# EAGLE design ISS-Notify (EAGLE 7.1.0)
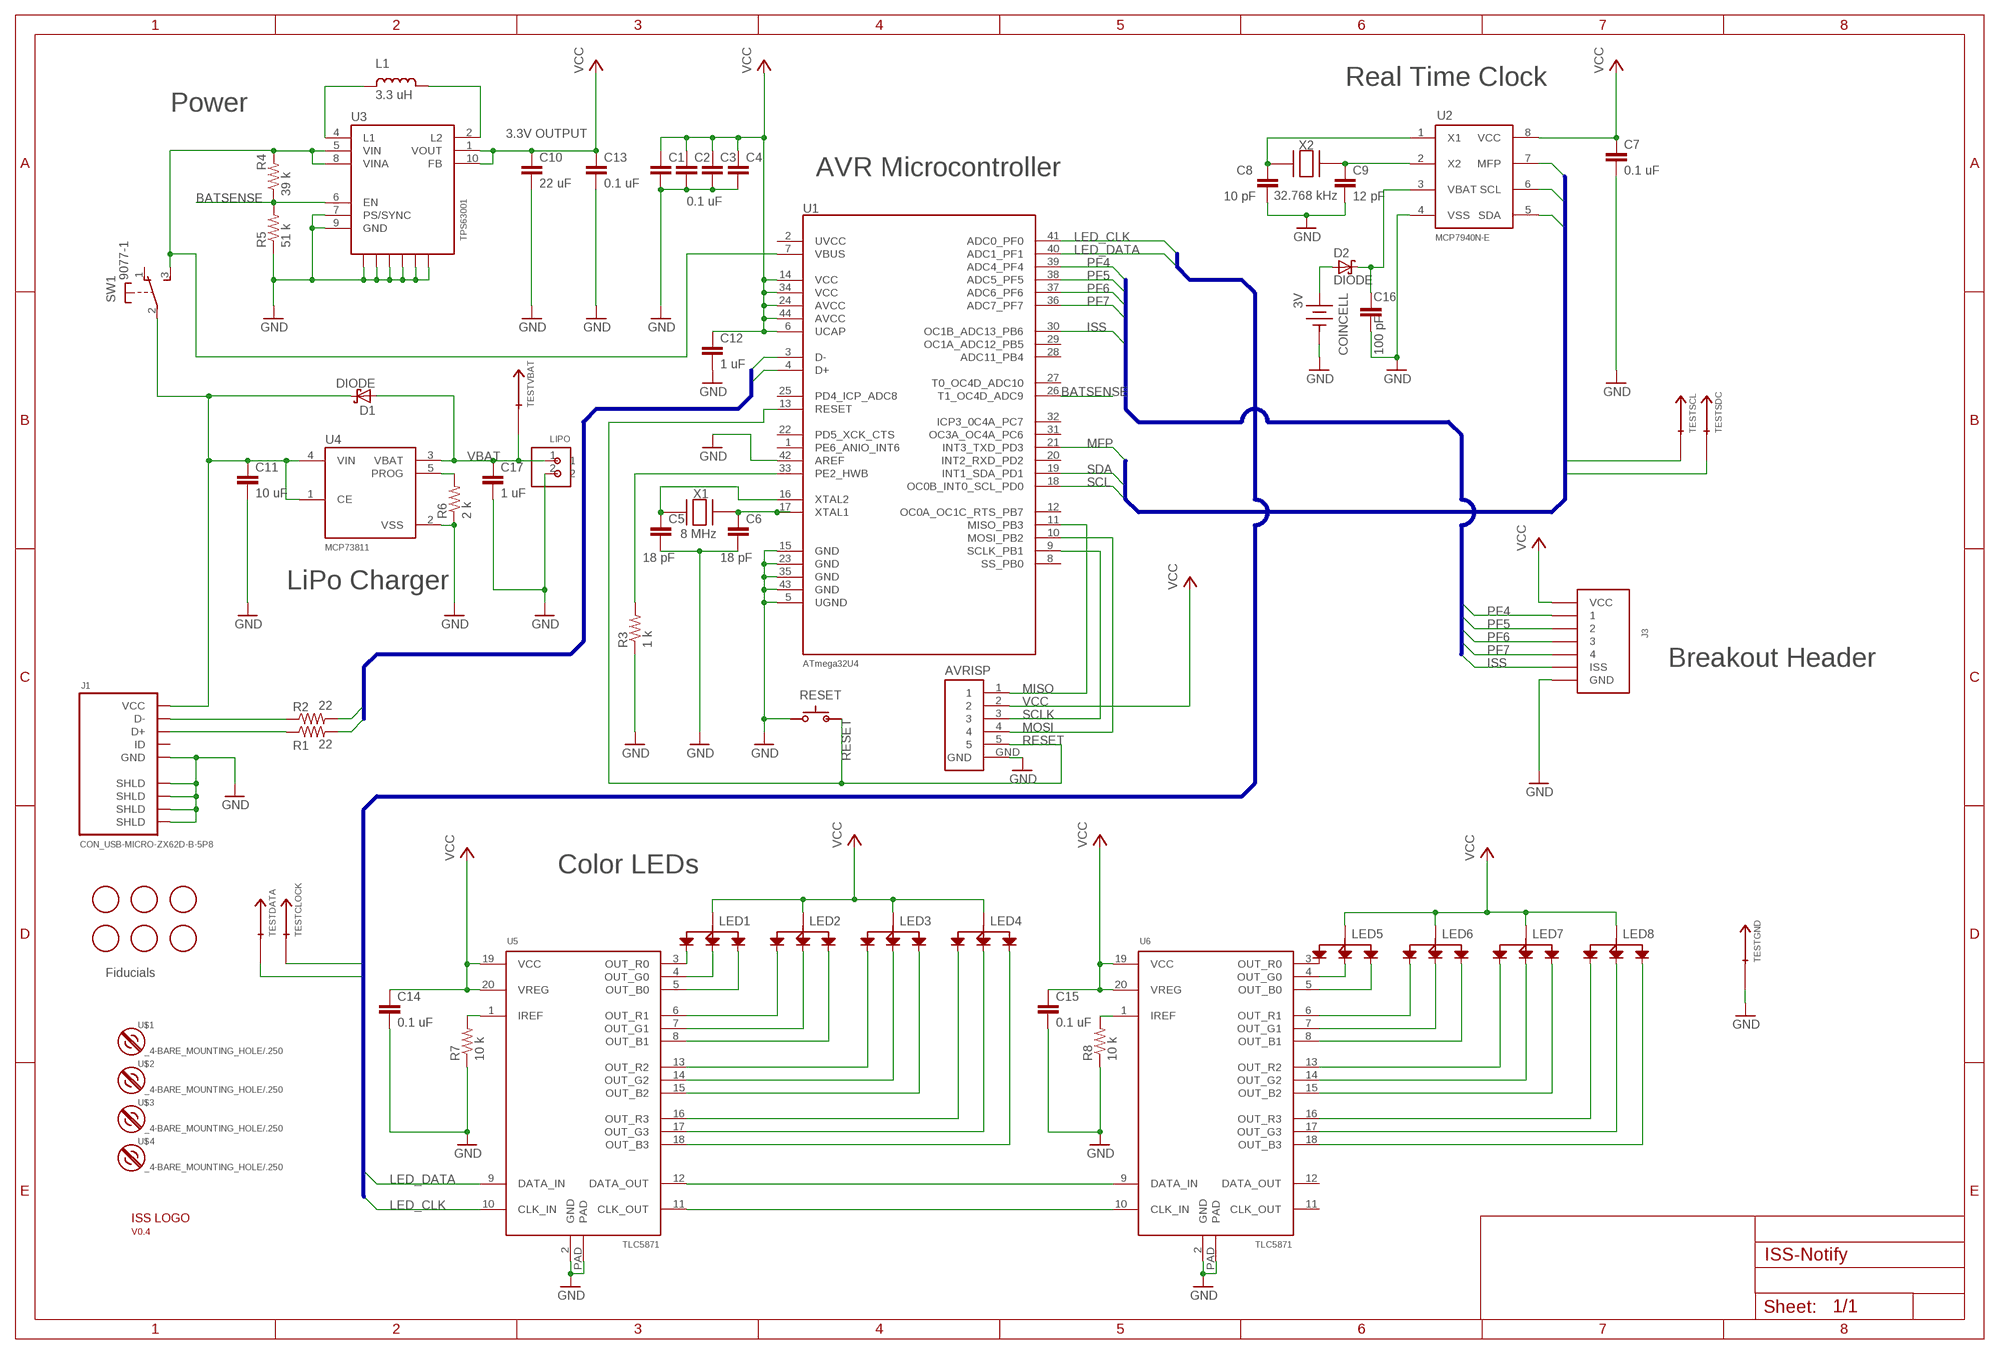
[diagram p0: schematic, sheet 1]

## Parts
AVRISP  AVRISP  [AVRISP]
C1  0.1 uF  C-EU0603-C-NOSILK  [0603-C-NOSILK]
C2  0.1 uF  C-EU0603-C-NOSILK  [0603-C-NOSILK]
C3  0.1 uF  C-EU0603-C-NOSILK  [0603-C-NOSILK]
C4  0.1 uF  C-EU0603-C-NOSILK  [0603-C-NOSILK]
C5  18 pF  C-EU0603-C-NOSILK  [0603-C-NOSILK]
C6  18 pF  C-EU0603-C-NOSILK  [0603-C-NOSILK]
C7  0.1 uF  C-EU0603-C-NOSILK  [0603-C-NOSILK]
C8  10 pF  C-EU0603-C-NOSILK  [0603-C-NOSILK]
C9  12 pF  C-EU0603-C-NOSILK  [0603-C-NOSILK]
C10  22 uF  C-EU0805-C-NOSILK  [0805-C-NOSILK]
C11  10 uF  C-EU0805-C-NOSILK  [0805-C-NOSILK]
C12  1 uF  C-EU0603-C-NOSILK  [0603-C-NOSILK]
C13  0.1 uF  C-EU0603-C-NOSILK  [0603-C-NOSILK]
C14  0.1 uF  C-EU0603-C-NOSILK  [0603-C-NOSILK]
C15  0.1 uF  C-EU0603-C-NOSILK  [0603-C-NOSILK]
C16  100 pF  C-EU0603-C-NOSILK  [0603-C-NOSILK]
C17  1 uF  C-EU0603-C-NOSILK  [0603-C-NOSILK]
COINCELL  3V  COINCELL  [COINCELL]
D1  DIODE  [0805-DIODE]
D2  DIODE  [0805-DIODE]
J1  CON_USB-MICRO-ZX62D-B-5P8  [USBMICROSMT-HIROSE]
J3  PROTOSPACE2  [PROTOSPACE2]
L1  3.3 uH  PWR_INDUCTOR  [0805-C-NOSILK]
LED1  RGBLED  [SMDRGBLED]
LED2  RGBLED  [SMDRGBLED]
LED3  RGBLED  [SMDRGBLED]
LED4  RGBLED  [SMDRGBLED]
LED5  RGBLED  [SMDRGBLED]
LED6  RGBLED  [SMDRGBLED]
LED7  RGBLED  [SMDRGBLED]
LED8  RGBLED  [SMDRGBLED]
LIPO  JST2  [JSTHEAD]
R1  22  R-US_0603-C-NOSILK  [0603-C-NOSILK]
R2  22  R-US_0603-C-NOSILK  [0603-C-NOSILK]
R3  1 k  R-US_0603-C-NOSILK  [0603-C-NOSILK]
R4  39 k  R-US_0603-C-NOSILK  [0603-C-NOSILK]
R5  51 k  R-US_0603-C-NOSILK  [0603-C-NOSILK]
R6  2 k  R-US_0603-C-NOSILK  [0603-C-NOSILK]
R7  10 k  R-US_0603-C-NOSILK  [0603-C-NOSILK]
R8  10 k  R-US_0603-C-NOSILK  [0603-C-NOSILK]
RESET  SWITCH  [SWITCH]
SW1  9077-1  [ESWITCH]
TESTCLOCK  TESTPIN  [TESTPIN]
TESTDATA  TESTPIN  [TESTPIN]
TESTGND  TESTPIN  [TESTPIN]
TESTSCL  TESTPIN  [TESTPIN]
TESTSDC  TESTPIN  [TESTPIN]
TESTVBAT  TESTPIN  [TESTPIN]
U1  ATMEGA32U4  [TQFP-44]
U2  MCP7940N  [MCP7940N]
U3  TPS63001  [QFN10]
U4  MCP73811  [SOT23-5L]
U5  TLC5971  [R-PDSO-G20]
U6  TLC5971  [R-PDSO-G20]
U$1  _4-BARE_MOUNTING_HOLE/.250  [_4/.250-BARE+STD_WASHER]
U$2  _4-BARE_MOUNTING_HOLE/.250  [_4/.250-BARE+STD_WASHER]
U$3  _4-BARE_MOUNTING_HOLE/.250  [_4/.250-BARE+STD_WASHER]
U$4  _4-BARE_MOUNTING_HOLE/.250  [_4/.250-BARE+STD_WASHER]
U$5  V0.4  LOGO  [LOGO]
U$6  FIDUCIAL  [FIDUCIAL_1MM]
U$7  FIDUCIAL  [FIDUCIAL_1MM]
U$8  FIDUCIAL  [FIDUCIAL_1MM]
U$9  FIDUCIAL  [FIDUCIAL_1MM]
U$10  FIDUCIAL  [FIDUCIAL_1MM]
U$11  FIDUCIAL  [FIDUCIAL_1MM]
X1  8 MHz  CX5Z  [CX5Z]
X2  32.768 kHz  ABS10  [ABS10]

## Nets
BATSENSE: R4.1 R5.2 U1.26(T1_OC4D_ADC9) U3.6(EN)
D+: R1.2 U1.4(D+)
D-: R2.2 U1.3(D-)
GND: AVRISP.GND C1.2 C2.2 C3.2 C4.2 C5.2 C6.2 C7.2 C8.2 C9.2 C10.2 C11.2 C12.2 C13.2 C14.2 C15.2 C16.2 C17.2 COINCELL.GND J1.P5(GND) J1.P$1(SHLD) J1.P$2(SHLD) J1.P$3(SHLD) J1.P$4(SHLD) J3.GND LIPO.2 R3.1 R5.1 R6.1 R7.1 R8.1 RESET.3 TESTGND.P$1(TEST) U1.5(UGND) U1.15(GND) U1.23(GND) U1.35(GND) U1.42(AREF) U1.43(GND) U2.4(VSS) U3.3(PGND) U3.7(PS/SYNC) U3.9(GND) U3.PAD(GNDPAD) U3.PGND1 U3.PGND2 U3.PGND3 U3.PGND4 U4.2(VSS) U5.2(GND) U5.PAD U6.2(GND) U6.PAD
ISS: J3.ISS U1.30(OC1B_ADC13_PB6)
LED_CLK: TESTCLOCK.P$1(TEST) U1.41(ADC0_PF0) U5.10(CLK_IN)
LED_DATA: TESTDATA.P$1(TEST) U1.40(ADC1_PF1) U5.9(DATA_IN)
MFP: U1.21(INT3_TXD_PD3) U2.7(MFP)
MISO: AVRISP.1 U1.11(MISO_PB3)
MOSI: AVRISP.4 U1.10(MOSI_PB2)
N$1: L1.1(A) U3.4(L1)
N$2: L1.2(C) U3.2(L2)
N$4: J1.P3(D+) R1.1
N$5: J1.P2(D-) R2.1
N$6: C5.1 U1.16(XTAL2) X1.1
N$7: C9.1 U2.2(X2) X2.@1
N$8: C8.1 U2.1(X1) X2.1
N$10: C6.1 U1.17(XTAL1) X1.3
N$11: COINCELL.POS1(VBAT) D2.A
N$12: R6.2 U4.5(PROG)
N$13: U5.11(CLK_OUT) U6.10(CLK_IN)
N$14: U5.12(DATA_OUT) U6.9(DATA_IN)
N$15: C16.1 D2.C U2.3(VBAT)
N$16: LED2.BLUE(B) U5.8(OUT_B1)
N$17: R7.2 U5.1(IREF)
N$18: R8.2 U6.1(IREF)
N$19: LED3.RED(R) U5.13(OUT_R2)
N$20: LED3.GREEN(G) U5.14(OUT_G2)
N$21: LED3.BLUE(B) U5.15(OUT_B2)
N$22: LED1.RED(R) U5.3(OUT_R0)
N$23: LED1.GREEN(G) U5.4(OUT_G0)
N$24: LED1.BLUE(B) U5.5(OUT_B0)
N$25: LED2.RED(R) U5.6(OUT_R1)
N$26: LED2.GREEN(G) U5.7(OUT_G1)
N$27: LED4.RED(R) U5.16(OUT_R3)
N$28: LED4.GREEN(G) U5.17(OUT_G3)
N$29: LED4.BLUE(B) U5.18(OUT_B3)
N$30: LED7.RED(R) U6.13(OUT_R2)
N$31: LED5.RED(R) U6.3(OUT_R0)
N$32: LED5.GREEN(G) U6.4(OUT_G0)
N$33: LED5.BLUE(B) U6.5(OUT_B0)
N$34: LED6.RED(R) U6.6(OUT_R1)
N$35: LED6.GREEN(G) U6.7(OUT_G1)
N$36: LED6.BLUE(B) U6.8(OUT_B1)
N$37: LED7.GREEN(G) U6.14(OUT_G2)
N$38: LED7.BLUE(B) U6.15(OUT_B2)
N$39: LED8.RED(R) U6.16(OUT_R3)
N$40: LED8.GREEN(G) U6.17(OUT_G3)
N$41: LED8.BLUE(B) U6.18(OUT_B3)
N$42: R3.2 U1.33(PE2_HWB)
PF4: J3.1 U1.39(ADC4_PF4)
PF5: J3.2 U1.38(ADC5_PF5)
PF6: J3.3 U1.37(ADC6_PF6)
PF7: J3.4 U1.36(ADC7_PF7)
RESET: AVRISP.5 RESET.1 U1.13(RESET)
SCL: TESTSCL.P$1(TEST) U1.18(OC0B_INT0_SCL_PD0) U2.6(SCL)
SCLK: AVRISP.3 U1.9(SCLK_PB1)
SDA: TESTSDC.P$1(TEST) U1.19(INT1_SDA_PD1) U2.5(SDA)
VBAT: C17.1 D1.A LIPO.1 TESTVBAT.P$1(TEST) U4.3(VBAT)
VCC: AVRISP.2 C1.1 C2.1 C3.1 C4.1 C7.1 C10.1 C12.1 C13.1 C14.1 C15.1 J3.VCC LED1.ANODE LED2.ANODE LED3.ANODE LED4.ANODE LED5.ANODE LED6.ANODE LED7.ANODE LED8.ANODE U1.6(UCAP) U1.14(VCC) U1.24(AVCC) U1.34(VCC) U1.44(AVCC) U2.8(VCC) U3.1(VOUT) U3.10(FB) U5.19(VCC) U5.20(VREG) U6.19(VCC) U6.20(VREG)
VIN: R4.2 SW1.3(S) U1.7(VBUS) U3.5(VIN) U3.8(VINA)
VUSB: C11.1 D1.C J1.P1(VCC) SW1.2(P) U4.1(CE) U4.4(VIN)
Unconnected: J1.P4(ID) SW1.1(O) U1.1(PE6_ANIO_INT6) U1.8(SS_PB0) U1.12(OC0A_OC1C_RTS_PB7) U1.20(INT2_RXD_PD2) U1.22(PD5_XCK_CTS) U1.25(PD4_ICP_ADC8) U1.27(T0_OC4D_ADC10) U1.28(ADC11_PB4) U1.29(OC1A_ADC12_PB5) U1.31(OC3A_OC4A_PC6) U1.32(ICP3_0C4A_PC7) U6.11(CLK_OUT) U6.12(DATA_OUT)

## Buses
D+,D-
MFP,SCL,SDA
LED_CLK,LED_DATA
PF4,PF5,PF6,PF7,ISS

## Notes on the sheet
- Real Time Clock
- Power
- 3.3V OUTPUT
- AVR Microcontroller
- LiPo Charger
- Breakout Header
- Color LEDs
- Fiducials

## Power pins joined to a net without a drawn wire
UVCC: U1.2(UVCC)

## Library data of the parts
AVRISP = ISS-Notify:AVRISP: ISP header for AVR
C1-C17 = rcl_custom:C-EU: CAPACITOR, European symbol
COINCELL = ISS-Notify:COINCELL
D1 D2 = ISS-Notify:DIODE: Schottky Power Rectifier
J1 = ISS-Notify:CON_USB-MICRO-ZX62D-B-5P8
J3 = ISS-Notify:PROTOSPACE2
L1 = ISS-Notify:PWR_INDUCTOR: 3.3 uH Inductor AIML-0805-3R3K-T
LED1-LED8 = ISS-Notify:RGBLED
LIPO = ISS-Notify:JST2: JST Battery Connector
R1-R8 = rcl_custom:R-US_: RESISTOR, American symbol
RESET = ISS-Notify:SWITCH: Tall micro push button
SW1 = ISS-Notify:9077-1: MARQUARDT SWITCH 9077.0100 Distributor: Buerklin <https://www.buerklin.com/default.asp?event=ShowArtikel%2812G2820%29&l=d&jump=ArtNr_12G2820>
TESTCLOCK TESTDATA TESTGND TESTSCL TESTSDC TESTVBAT = ISS-Notify:TESTPIN: Pogo Pin Test pin hole
U1 = ISS-Notify:ATMEGA32U4: ATMega32U4 AVR embedded microcontroller with USB, UART, SPI, I2C, 32K program space, 1K eeprom, 2.5 K sram
U2 = ISS-Notify:MCP7940N: Low Power Real Time Clock
U3 = ISS-Notify:TPS63001: High efficiency buck boost SPS
U4 = ISS-Notify:MCP73811: Li-Ion Charger
U5 U6 = ISS-Notify:TLC5971: RGB LED Driver with PWM, Constant current, RGB Color aware.
U$1-U$4 = ISS-Notify:_4-BARE_MOUNTING_HOLE: 1/8" drill hole for #4 screw mount
U$5 = ISS-Notify:LOGO
U$6-U$11 = ISS-Notify:FIDUCIAL
X1 = ISS-Notify:CX5Z: 8 MHz Crystal
X2 = ISS-Notify:ABS10: 32.768 kHz Crystal 7 pF

## Board
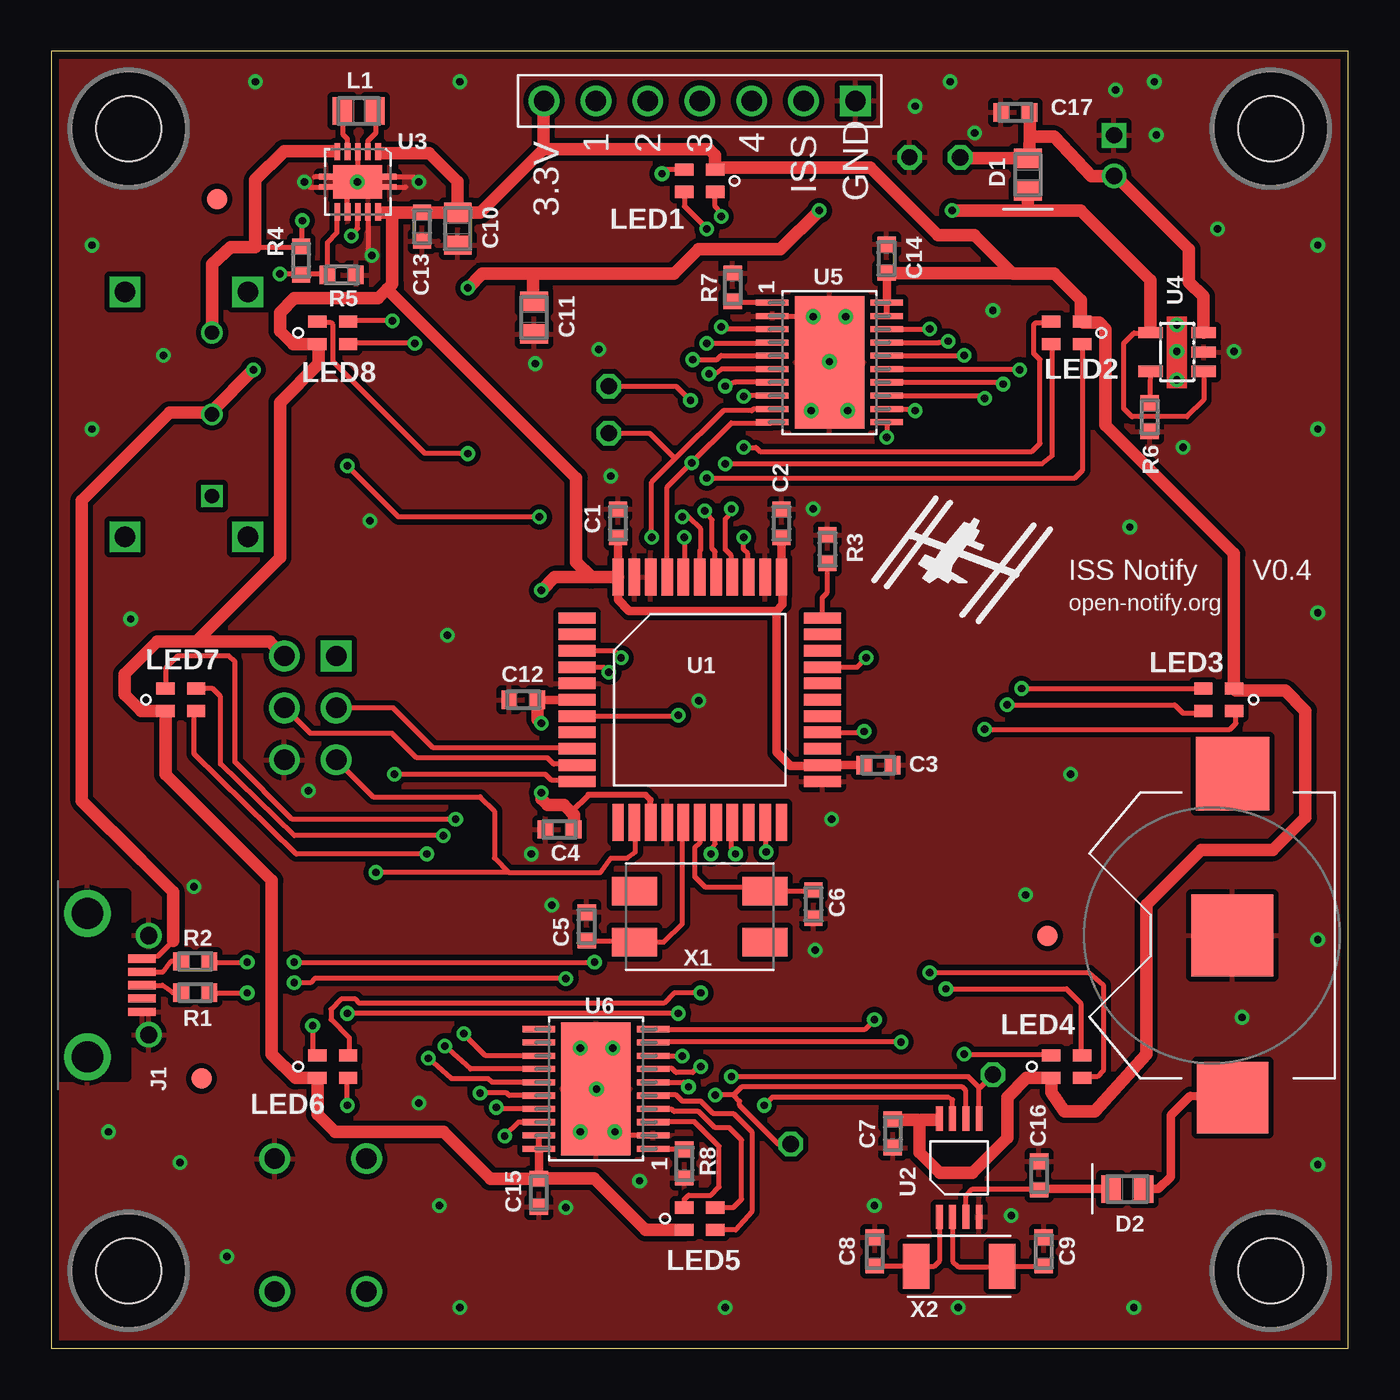
[diagram p1: board, top side]
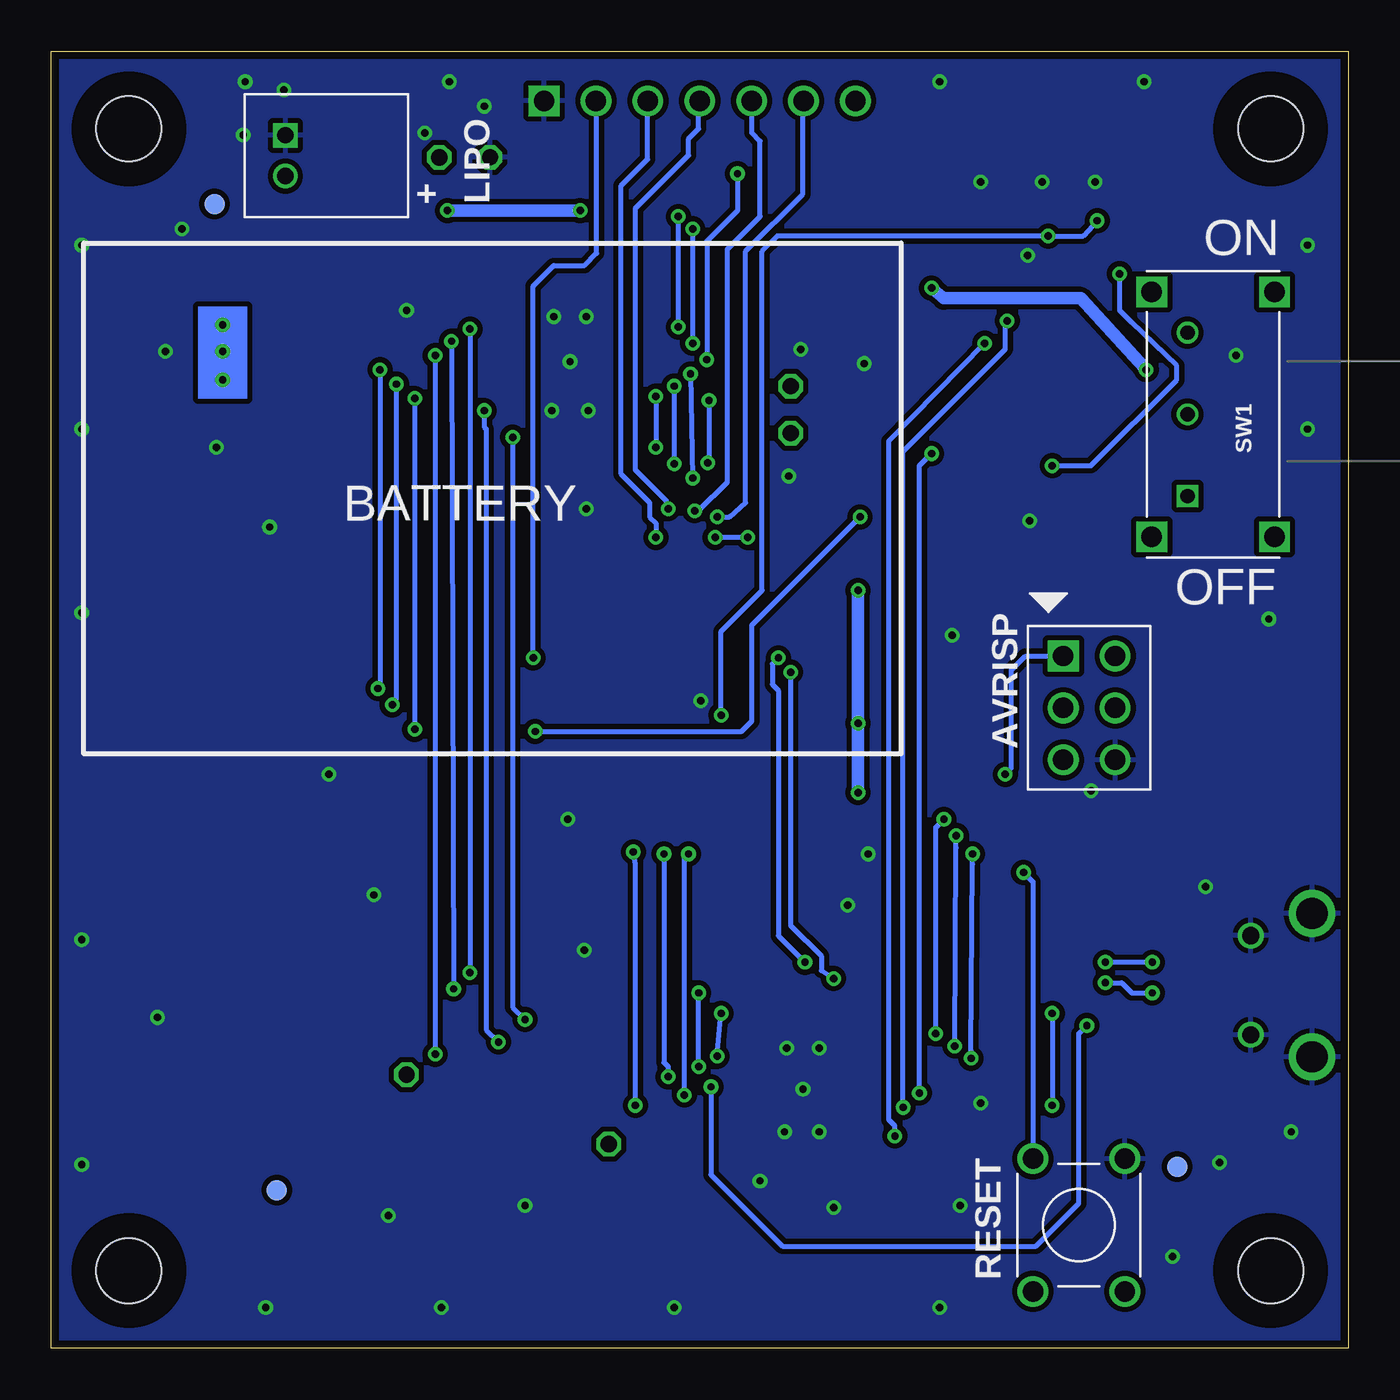
[diagram p2: board, bottom side, seen from below]

Size 63.5 x 63.5 mm. Coordinates in mm from the lower left corner, seen from the top.
Outline: 0,0 63.5,0 63.5,63.5 0,63.5 0,0
Copper layers (1*16): Top 0.0356mm / dielectric 1.5011mm / Bottom 0.0356mm
Design rules "LaenPCBOrder": minimum track width 6mil, minimum drill 13mil, track to track 6mil, track to pad 6mil, pad to pad 6mil, via to via 6mil, smd to smd 6mil, copper to edge 15mil, drill to drill 6mil, minimum pad ring 7mil, minimum via ring 7mil, stop-mask expansion 3mil, vias tented up to drill 0mil, thermal gap 10mil

### Footprints (pad centres in the part's own frame; a part is rotated, then mirrored left to right if it is on the bottom)
AVRISP = drill 1 square: 1 -1.27,2.54 | drill 1: 2 1.27,2.54; 3 -1.27,0; 4 1.27,0; 5 -1.27,-2.54; GND 1.27,-2.54
0603-C-NOSILK = smd 0.75 x 0.9: 1 -0.7,0; 2 0.7,0
0805-C-NOSILK = smd 0.95 x 1.35: 1 -0.8,0; 2 0.8,0
COINCELL = smd 4 x 4: GND 0,0 | smd 3.5 x 3.5: POS1 -7.95,0 | smd 3.6 x 3.6: POS2 7.9,0
0805-DIODE = smd 0.95 x 1.35: A 0.8,0; C -0.8,0
USBMICROSMT-HIROSE = smd 0.4 x 1.35: P1 -1.046,2.675; P2 -0.396,2.675; P3 0.254,2.675; P4 0.904,2.675; P5 1.554,2.675 | drill 1.524: P$1 3.764,0; P$2 -3.256,0 | drill 0.838: P$3 -2.171,3; P$4 2.679,3
PROTOSPACE2 = drill 1: 1 -5.08,0; 2 -2.54,0; 3 0,0; 4 2.54,0; ISS 5.08,0; VCC -7.62,0 | drill 1 square: GND 7.62,0
SMDRGBLED = smd 0.9 x 0.6: ANODE -0.75,-0.55; BLUE 0.75,-0.55; GREEN 0.75,0.55; RED -0.75,0.55
JSTHEAD = drill 0.8: 1 -1,0 | drill 0.8 square: 2 1,0
SWITCH = drill 1: 1 -3.25,-2.25; 2 3.25,-2.25; 3 -3.25,2.25; 4 3.25,2.25
ESWITCH = drill 0.7 square: 1 -4,0 | drill 0.7: 2 0,0; 3 4,0 | drill 1 square: CASE@1 -6,-4.25; CASE@2 6,-4.25; CASE@3 6,1.75; CASE@4 -6,1.75
TESTPIN = drill 0.8 octagon: P$1 0,0
TQFP-44 = smd 1.8 x 0.56: 1 -6,4; 2 -6,3.2; 3 -6,2.4; 4 -6,1.6; 5 -6,0.8; 6 -6,0; 7 -6,-0.8; 8 -6,-1.6; 9 -6,-2.4; 10 -6,-3.2; 11 -6,-4; 23 6,-4; 24 6,-3.2; 25 6,-2.4; 26 6,-1.6; 27 6,-0.8; 28 6,0; 29 6,0.8; 30 6,1.6; 31 6,2.4; 32 6,3.2; 33 6,4 | smd 0.56 x 1.8: 12 -4,-6; 13 -3.2,-6; 14 -2.4,-6; 15 -1.6,-6; 16 -0.8,-6; 17 0,-6; 18 0.8,-6; 19 1.6,-6; 20 2.4,-6; 21 3.2,-6; 22 4,-6; 34 4,6; 35 3.2,6; 36 2.4,6; 37 1.6,6; 38 0.8,6; 39 0,6; 40 -0.8,6; 41 -1.6,6; 42 -2.4,6; 43 -3.2,6; 44 -4,6
MCP7940N = smd 0.34 x 1.19: 1 -0.975,-2.4; 2 -0.325,-2.4; 3 0.325,-2.4; 4 0.975,-2.4; 5 0.975,2.4; 6 0.325,2.4; 7 -0.325,2.4; 8 -0.975,2.4
QFN10 = smd 0.28 x 0.85: 1 -1,-1.475; 2 -0.5,-1.475; 3 0,-1.475; 4 0.5,-1.475; 5 1,-1.475; 6 1,1.475; 7 0.5,1.475; 8 0,1.475; 9 -0.5,1.475; 10 -1,1.475 | smd 2.4 x 1.65: PAD 0,0 | smd 0.7 x 0.28: PGND1 1.55,0.25; PGND2 -1.55,0.25; PGND3 -1.55,-0.25; PGND4 1.55,-0.25
SOT23-5L = smd 0.55 x 1.2: 1 -0.95,-1.3; 2 0,-1.3; 3 0.95,-1.3; 4 0.95,1.3; 5 -0.95,1.3
R-PDSO-G20 = smd 0.3 x 1.6: 1 -2.925,-2.8; 2 -2.275,-2.8; 3 -1.625,-2.8; 4 -0.975,-2.8; 5 -0.325,-2.8; 6 0.325,-2.8; 7 0.975,-2.8; 8 1.625,-2.8; 9 2.275,-2.8; 10 2.925,-2.8; 11 2.925,2.8; 12 2.275,2.8; 13 1.625,2.8; 14 0.975,2.8; 15 0.325,2.8; 16 -0.325,2.8; 17 -0.975,2.8; 18 -1.625,2.8; 19 -2.275,2.8; 20 -2.925,2.8 | smd 6.5 x 3.4: PAD 0,0
_4/.250-BARE+STD_WASHER = hole 3.175: 0,0; 0,0
FIDUCIAL_1MM = smd 1 x 1: 1 0,0
CX5Z = smd 2.2 x 1.4: 1 -3.2,-1.25; 2 3.2,-1.25; 3 3.2,1.25; 4 -3.2,1.25
ABS10 = smd 1.3 x 2.2: 1 -2.1,0; @1 2.1,0

### Placement (x,y rotation side)
AVRISP  12.68,31.35 0 bottom
C1  27.75,40.39 90 top
C2  35.75,40.39 90 top
C3  40.49,28.55 0 top
C4  24.89,25.4 180 top
C5  26.22,20.66 90 top
C6  37.32,21.74 270 top
C7  41.2,10.52 270 top
C8  40.31,4.74 90 top
C9  48.59,4.74 90 top
C10  19.9,54.8 270 top
C11  23.64,50.45 270 top
C12  23.11,31.75 180 top
C13  18.16,54.9 270 top
C14  40.89,53.34 90 top
C15  23.88,7.62 270 top
C16  48.36,8.47 90 top
C17  47.2,60.5 180 top
COINCELL  57.82,20.22 90 top
D1  47.81,57.45 90 top
D2  52.68,7.8 0 top
J1  1.78,18.03 270 top
J3  31.75,61.06 0 top
L1  15.06,60.56 0 top
LED1  31.75,57.15 180 top
LED2  49.71,49.71 180 top
LED3  57.15,31.75 180 top
LED4  49.71,13.79 0 top
LED5  31.75,6.35 0 top
LED6  13.79,13.79 0 top
LED7  6.35,31.75 0 top
LED8  13.79,49.71 0 top
LIPO  52.03,58.38 90 bottom
R1  7.06,17.42 0 top
R2  7.06,18.94 0 top
R3  38,39.12 270 top
R4  12.24,53.25 90 top
R5  14.23,52.54 180 top
R6  53.77,45.58 90 top
R7  33.36,51.93 270 top
R8  31,9.05 90 top
RESET  13.19,6.04 270 bottom
SW1  7.87,45.72 90 bottom
TESTCLOCK  27.3,47.1 0 top
TESTDATA  27.3,44.8 0 top
TESTGND  42.01,58.3 0 top
TESTSCL  36.2,10 0 top
TESTSDC  46.1,13.4 0 top
TESTVBAT  44.5,58.3 0 top
U1  31.75,31.75 0 top
U2  44.45,8.84 0 top
U3  15.01,57.1 180 top
U4  55.12,48.77 90 top
U5  38.1,48.26 270 top
U6  26.67,12.7 90 top
U$1  3.81,59.69 0 top
U$2  59.69,59.69 0 top
U$3  59.69,3.81 0 top
U$4  3.81,3.81 0 top
U$5  40.1,36.1 0 top
U$6  8.13,56.26 0 top
U$7  8.38,8.89 0 bottom
U$8  7.37,13.21 0 top
U$9  48.77,20.19 0 top
U$10  55.5,56.01 0 bottom
U$11  52.45,7.75 0 bottom
X1  31.75,21.14 0 top
X2  44.45,4.02 0 top

### Tracks (layer width: path | path; a pad name or v marks a point on that pad's centre or on a via)
BATSENSE  (via drill 0.36)
  Top 0.254: U1.26 39.75,30.15 v39.8,30.2 | v23.9,40.7 17,40.7 v14.5,43.2 | v11.2,52.6 12.59,52.6 | 12.59,52.6 R4.1 | 13.98,55.6 U3.6 14,54.6 13.53,54.13 R5.2 13.47,52.6 12.59,52.6
  Top 0.61: R4.1
  Bottom 0.254: v39.8,30.2 29.7,30.2 29.2,30.7 29.2,35.4 v23.9,40.7 | v14.5,43.2 12.6,43.2 8.4,47.4 8.4,48.1 10.6,50.2 11.2,50.8 v11.2,52.6
D+  (via drill 0.36)
  Top 0.254: U1.4 27.05,33.35 v27.3,33.1 | R1.2 7.74,17.4 v9.6,17.4 | v25.2,18.1 12.9,18.1 12.7,17.9 v11.9,17.9
  Bottom 0.254: v27.3,33.1 27.3,20.7 25.8,19.2 25.8,18.5 v25.2,18.1 | v11.9,17.9 11.1,17.9 10.6,17.4 v9.6,17.4
D-  (via drill 0.36)
  Top 0.254: U1.3 27.55,34.15 v27.9,33.8 | R2.2 7.8,18.9 v9.6,18.9 | v11.9,18.9 v26.6,18.9
  Bottom 0.254: v26.6,18.9 27.9,20.2 27.9,32.2 28.2,32.5 28.2,33.5 v27.9,33.8 | v9.6,18.9 v11.9,18.9
GND  (via drill 0.36)
  Top 0.254: U3.3 U3.PAD 14.9,57.1 14.5,56.7 14.5,55.63 U3.7 | U6.2 27.57,10.43 26.8,11.2 26.8,12.57 U6.PAD | 15.9,53.5 v15.7,53.5 15.51,53.69 U3.9 | U5.2 37.27,50.53 v37.3,50.5 | v12.4,57.1 12.65,56.85 U3.PGND1 | 12.89,57.34 U3.PGND4 | U3.PGND3 17.76,57.34 v18,57.1 | 16.61,56.84 17.37,56.84 | 16.54,57.34 U3.PGND3 | U3.PGND3
  other vias: 15.6,40.5 3.9,35.7 5.5,48.6 2.8,10.6 19,7 18,12 20,2 33,2 53,2 44.4,2 40.3,7 47,6.5 58.3,16.2 28.8,8.2 25.2,6.9 26.7,12.7 25.9,14.7 27.5,14.7 25.9,10.6 27.6,10.6 37.4,19.5 24.5,21.7 23.5,24.2 47.7,22.2 49.9,28.1 31.7,31.7 38.2,25.9 52.8,40.2 55.4,44.1 46.1,50.8 23.7,48.2 27.4,42.7 37.3,41.1 19.4,34.9 7,22.6 6.3,9.1 38.1,48.3 57.1,54.8 54.1,59.4 52.1,61.6 42.3,60.8 57.9,48.8 38.9,50.5 39,45.9 37.2,45.9 15,57.1 12.6,27.3 2,45 2,54 10,62 20,62 44,62 54,62 62,54 62,45 62,36 62,20 62,9 8.6,4.5 26.8,48.9 45.2,59.5
  pour Top (isolate 0.254): 0,0 0,63.5 63.5,63.5 63.5,0
  pour Bottom (isolate 0.254): 0,0 0,63.5 63.5,63.5 63.5,0
ISS  (via drill 0.36)
  Top 0.254: U1.30 39.45,33.35 v39.9,33.8
  Bottom 0.254: v39.9,33.8 39.9,52 38.9,53 37.4,53 36.8,53.6 36.8,61.23 J3.ISS
LED_CLK  (via drill 0.36)
  Top 0.254: U1.41 30.15,42.15 v31.35,43.35 33.3,45.3 35.27,45.3 U5.10 | TESTCLOCK.P$1 30.6,47.1 v31.3,46.4
  Bottom 0.254: v31.3,46.4 31.3,43.4 v31.35,43.35
LED_DATA  (via drill 0.36)
  Top 0.254: v31,39.7 31,37.8 | v29.4,39.7 29.4,42.4 30.55,43.55 | U5.9 34.38,45.98 34.3,45.9 32.9,45.9 30.55,43.55 | TESTDATA.P$1 29.3,44.8 30.55,43.55
  Top 0.305: 31,37.8 U1.40
  Bottom 0.254: v29.4,39.7 v31,39.7
MFP  (via drill 0.36)
  Top 0.254: U2.7 44.12,12.18 43.9,12.3 35.3,12.3 v34.9,11.9 | v35,24.3 35,25.7 U1.21
  Bottom 0.254: v34.9,11.9 34.9,23.7 v35,24.3
MISO  (via drill 0.36)
  Top 0.254: U1.11 25.7,27.8 24.5,27.8 24.2,28.1 v16.8,28.1
  Bottom 0.254: v16.8,28.1 16.5,28.4 16.5,33.2 15.81,33.89 AVRISP.1
MOSI
  Top 0.254: U1.10 25.3,28.6 24.6,28.6 24.3,28.9 17.9,28.9 16.7,30.1 12.7,30.1 11.45,31.35 AVRISP.4
N$1
  Top 0.254: U3.4 14.51,59.19 14.3,59.4 14.3,60.62 L1.1
N$2
  Top 0.254: U3.2 15.51,59.11 15.9,59.5 15.9,60.62 L1.2
N$4
  Top 0.254: R1.1 5.95,17.42 5.46,17.78 J1.P3
N$5
  Top 0.254: R2.1 5.86,18.94 5.46,18.41 4.47,18.41 J1.P2
N$6
  Top 0.254: C5.1 28.38,19.96 X1.1 29.99,19.89 30.9,20.8 30.9,25.7 U1.16
N$7
  Top 0.254: U2.2 44.12,4.28 44.4,4 46.53,4 X2.@1 48.45,4.02 C9.1
N$8
  Top 0.254: U2.1 43.48,4.28 43.2,4 42.37,4 X2.1 40.45,4.02 C8.1
N$9  (via drill 0.36)
  other vias: 55.1,48.8
N$10
  Top 0.254: U1.17 31.75,24.75 31.5,24.5 31.5,23.1 32,22.6 34.94,22.6 X1.3 37.27,22.39 C6.1
N$11
  Top 0.406: COINCELL.POS1 55.77,12.37 54.8,11.4 54.8,8.4 54.2,7.8 D2.A
N$12
  Top 0.254: R6.2 U4.5
N$13  (via drill 0.36)
  Top 0.254: U5.11 v40.9,44.6 | v40.3,16.1 39.8,15.6 29.5,15.6 U6.10
  Bottom 0.254: v40.9,44.6 40.9,16.7 v40.3,16.1
N$14  (via drill 0.36)
  Top 0.254: U5.12 42.19,45.98 v42.3,45.9 | v41.6,15 29.5,15 U6.9
  Bottom 0.254: v41.6,15 42.2,15.6 42.2,45 42.3,45.1 v42.3,45.9
N$15
  Top 0.254: U2.3 44.77,7.47 45.1,7.8 48.33,7.8 C16.1
  Top 0.406: D2.C 48.5,7.8 C16.1
N$16  (via drill 0.36)
  Top 0.254: U5.8 33.94,46.63 v33.9,46.6 | LED2.BLUE 48.9,50.2 48.2,50.2 48.1,50.1 48.1,48.7 48.4,48.4 48.4,44.3 48,43.9 34.7,43.9 34.5,44.1 v33.9,44.1
  Bottom 0.254: v33.9,46.6 v33.9,44.1
N$17
  Top 0.254: U5.1 33.39,51.19 R7.2
N$18
  Top 0.254: U6.1 31.37,9.78 R8.2
N$19  (via drill 0.36)
  Top 0.254: U5.13 45.37,46.63 v45.7,46.5 | v45.7,30.3 57.7,30.3 58,30.6 58,31.1 LED3.RED
  Bottom 0.254: v45.7,46.5 v45.7,30.3
N$20  (via drill 0.36)
  Top 0.254: U5.14 46.31,47.28 v46.6,47.2 | v46.8,31.5 55,31.5 55.4,31.1 56.3,31.1 LED3.GREEN
  Bottom 0.254: v46.6,47.2 46.6,31.8 v46.8,31.5
N$21  (via drill 0.36)
  Top 0.254: U5.15 47.37,47.94 v47.4,47.9 | v47.5,32.3 LED3.BLUE
  Bottom 0.254: v47.4,47.9 47.4,32.4 v47.5,32.3
N$22  (via drill 0.36)
  Top 0.254: U5.3 32.91,49.88 v32.8,50 | v32.8,55.4 32.8,55.6 32.5,55.9 LED1.RED
  Bottom 0.254: v32.8,50 v32.8,55.4
N$23  (via drill 0.36)
  Top 0.254: LED1.GREEN 31,55.9 v32.1,54.8 | v32.1,49.2 35.27,49.2 U5.4
  Bottom 0.254: v32.1,54.8 v32.1,49.2
N$24  (via drill 0.36)
  Top 0.254: LED1.BLUE 30.1,57.7 v29.9,57.5 | v31.4,48.4 32.6,48.4 32.8,48.6 35.28,48.6 U5.5
  Bottom 0.254: v29.9,57.5 29.9,55.7 31.4,54.2 v31.4,48.4
N$25  (via drill 0.36)
  Top 0.254: U5.6 32.84,47.94 32.5,47.7 v32.2,47.7 | v32.1,42.6 50.1,42.6 50.5,43 50.5,49.12 LED2.RED
  Bottom 0.254: v32.2,47.7 v32.1,42.6
N$26  (via drill 0.36)
  Top 0.254: U5.7 33.48,47.28 v33,47.1 | LED2.GREEN 49,49.12 49,43.7 48.5,43.3 v33,43.3
  Bottom 0.254: v33,47.1 v33,43.3
N$27  (via drill 0.36)
  Top 0.254: U5.16 43.78,48.59 v44.7,48.6 | v44.7,14.4 48.9,14.4 LED4.RED
  Bottom 0.254: v44.7,48.6 v44.7,14.4
N$28  (via drill 0.36)
  Top 0.254: U5.17 43.47,49.23 v43.9,49.3 | v43.8,17.6 49.7,17.6 50.4,16.9 50.4,14.4 LED4.GREEN
  Bottom 0.254: v43.9,49.3 v43.8,17.6
N$29  (via drill 0.36)
  Top 0.254: U5.18 42.09,49.88 v43,49.9 | v43,18.4 50.8,18.4 51.5,17.8 51.5,13.6 51.2,13.3 50.52,13.3 LED4.BLUE
  Bottom 0.254: v43,49.9 v43,18.4
N$30  (via drill 0.36)
  Top 0.254: U6.13 21.27,14.32 v20.2,15.4 | v19.8,25.9 11.8,25.9 9,28.7 9,33.6 8.7,33.9 6.2,33.9 5.6,33.3 LED7.RED
  Bottom 0.254: v20.2,15.4 20.2,25.5 v19.8,25.9
N$31
  Top 0.254: LED5.RED 31,7.3 31.2,7.5 32.3,7.5 32.7,7.9 32.7,9.9 31.5,11.1 29.5,11.1 U6.3
N$32
  Top 0.254: LED5.GREEN 33.4,6.9 33.8,7.3 33.8,10.2 33.2,10.8 32.5,10.8 31.7,11.6 30.5,11.6 30.4,11.7 29.5,11.7 U6.4
N$33
  Top 0.254: LED5.BLUE 33.5,5.8 34.3,6.7 34.3,10.6 33.4,11.5 32.4,11.5 31.8,12.1 30.9,12.1 30.6,12.4 29.5,12.4 U6.5
N$34  (via drill 0.36)
  Top 0.254: U6.6 30.98,13.03 v31.2,12.8 | v12.8,15.8 12.8,14.58 LED6.RED
  Bottom 0.254: v31.2,12.8 31.2,8.5 27.7,5 15.3,5 13.2,7.1 13.2,15.4 v12.8,15.8
N$35  (via drill 0.36)
  Top 0.254: v31.8,17.4 30.5,17.4 30,16.9 15.1,16.9 14.9,17.1 14.2,17.1 13.7,16.6 13.7,16.1 14.6,15.2 14.6,14.4 LED6.GREEN | v31.8,13.8 31.7,13.8 31.4,13.5 30.6,13.5 30.4,13.7 29.5,13.7 U6.7
  Bottom 0.254: v31.8,13.8 v31.8,17.4
N$36  (via drill 0.36)
  Top 0.254: U6.8 30.62,14.32 v30.9,14.3 | v30.7,16.4 v14.5,16.4 | v14.5,11.9 14.5,13.2 LED6.BLUE
  Bottom 0.254: v30.9,14.3 v30.7,16.4 | v14.5,16.4 v14.5,11.9
N$37  (via drill 0.36)
  Top 0.254: U6.14 20.52,13.68 v19.27,14.8 | v19.2,25.1 11.9,25.1 8.3,28.6 8.3,31.9 7.9,32.3 LED7.GREEN
  Bottom 0.254: v19.27,14.8 19.2,24.5 v19.2,25.1
N$38  (via drill 0.36)
  Top 0.254: U6.15 21.57,13.03 21.4,13.2 19.6,13.2 v18.47,14.2 | v18.4,24.2 12,24.2 7,29.1 7,31.1 LED7.BLUE
  Bottom 0.254: v18.47,14.2 18.47,14.57 18.4,23.7 v18.4,24.2
N$39  (via drill 0.36)
  Top 0.254: U6.16 22.43,12.38 22.3,12.5 v21,12.5 | v20.4,43.8 18.3,43.8 13.8,48.3 13.8,50.1 13.7,50.2 13.1,50.2 LED8.RED
  Bottom 0.254: v21,12.5 21,43.2 v20.4,43.8
N$40  (via drill 0.36)
  Top 0.254: U6.17 21.88,11.72 v21.8,11.8 | v16.7,50.3 14.58,50.3 LED8.GREEN
  Bottom 0.254: v21.8,11.8 21.8,43.9 16.8,48.9 16.8,50.2 v16.7,50.3
N$41  (via drill 0.36)
  Top 0.254: U6.18 22.88,11.07 v22.2,10.4 | v17.8,49.2 14.58,49.2 LED8.BLUE
  Bottom 0.254: v17.8,49.2 22.5,44.4 22.5,11.2 22.2,10.9 v22.2,10.4
N$42
  Top 0.254: U1.33 37.75,36.75 38,37 R3.2
N$43  (via drill 0.36)
  other vias: 55.1,50.1
N$44  (via drill 0.36)
  other vias: 55.1,47.4
PF4  (via drill 0.36)
  Top 0.254: U1.39 31.75,39.05 31.8,39.1 31.8,40.1 31.2,40.7 v30.9,40.7
  Bottom 0.254: v30.9,40.7 30.3,40.7 29.5,41.4 29.5,53.7 26.7,56.5 26.7,61.23 J3.1
PF5  (via drill 0.36)
  Top 0.254: v32,41 32.35,40.55 32.35,39.15 32.5,39 32.5,37.8 U1.38
  Bottom 0.254: v32,41 31.8,41 30.4,42.4 30.4,53.8 28.8,55.4 28.8,59.1 29.2,59.5 29.2,61.25 J3.2
PF6  (via drill 0.36)
  Top 0.254: U1.37 33.3,37.8 33.3,38.8 33,39.1 33,40.6 33.3,40.9 v33.3,41.1
  Bottom 0.254: v33.3,41.1 33.4,41.5 34.9,43 34.9,55.8 32.3,58.4 32.3,59.2 31.8,59.7 31.8,61.21 J3.3
PF7  (via drill 0.36)
  Top 0.254: U1.36 34.1,37.8 34.1,38.9 33.9,39.1 v33.9,39.7
  Bottom 0.254: J3.4 34.3,61.25 34.3,58.2 35.6,56.9 35.6,42.8 34.2,41.4 34.2,40.7 33.9,40.4 v33.9,39.7
RESET  (via drill 0.36)
  Top 0.254: 22.4,23.3 21.7,24 21.7,26.3 21,27 15.76,27 AVRISP.5 | 22.4,23.3 26.9,23.3 27.4,24 28.2,24 28.6,24.3 28.6,25.7 U1.13 | 22.4,23.3 v15.9,23.3
  Bottom 0.254: v15.9,23.3 15.44,22.84 RESET.1
SCL  (via drill 0.36)
  Top 0.254: U2.6 44.77,12.62 44.6,12.8 33.8,12.8 33.4,12.4 | 33.4,12.4 v32.5,12.4 | v32.3,24.2 32.3,24.4 32.5,24.7 32.5,25.7 U1.18 | TESTSCL.P$1 35.6,10 33.7,11.9 33.7,12.1 33.4,12.4
  Bottom 0.254: v32.5,12.4 32.5,24 v32.3,24.2
SCLK
  Top 0.254: U1.9 25.7,29.4 18.7,29.4 16.75,31.35 AVRISP.3
SDA  (via drill 0.36)
  Top 0.254: U2.5 45.42,12.78 | 45.42,12.78 44.9,13.3 v33.3,13.3 | v33.5,24.2 33.5,24.3 33.3,24.5 33.3,25.7 U1.19 | 45.42,12.78 45.48,12.78 TESTSDC.P$1
  Bottom 0.254: v33.5,24.2 33.5,14 33.3,13.8 v33.3,13.3
VBAT
  Top 0.61: U4.3 56.4,49.74 56.4,51.5 55.7,52.2 55.7,53.8 52.12,57.38 LIPO.1 50.92,57.38 49.1,59.3 47.9,59.3 | 47.9,59.3 47.86,58.2 D1.A 44.75,58.25 TESTVBAT.P$1 | 47.9,59.3 C17.1
VCC  (via drill 0.36)
  Top 0.254: U3.10 16.18,55.62 16.2,55.6 | U2.8 43.34,11.24 43.3,11.2
  Top 0.305: U5.19 U5.20 | U6.19 U6.20 | U3.1 16.07,58.58 16.15,58.5 | U1.14 29.35,26.85 29.1,27.1 26.3,27.1 25.45,26.25
  Top 0.406: C14.1 U5.20 | U6.20 C15.1 | C1.1 U1.44 27.75,36.65 28.3,36.1 35.5,36.1 | C2.1 U1.34 35.8,37.7 35.8,36.4 35.5,36.1 | C12.1 U1.6 | 35.5,36.1 35.5,29.2 36.2,28.5 37.7,28.5 U1.24 C3.1
  Top 0.61: C10.1 19.9,57.1 18.5,58.5 16.15,58.5 | 16.2,55.6 16.8,55.6 | 16.8,55.6 C13.1 C10.1 | C10.1 21,55.6 24.1,58.7 | 24.1,58.7 32.2,58.7 32.5,58.4 LED1.ANODE 32.6,57.8 40.1,57.8 43.4,54.5 45.2,54.5 47.06,52.64 | C14.1 47.06,52.64 | 16.45,51.85 16,51.4 11.9,51.4 11.2,50.7 11.2,49.8 11.84,49.16 LED8.ANODE 13.1,49.1 13.1,48.2 11.2,46.3 11.2,38.7 7.1,34.6 | 16.45,51.85 16.7,52.1 16.7,55.5 16.8,55.6 | 7.1,34.6 5.2,34.6 3.6,33 3.6,32 4.4,31.2 LED7.ANODE 5.6,28.1 10.8,22.9 10.8,14.4 11.96,13.24 LED6.ANODE 13.04,11.46 13.9,10.6 19.2,10.6 21.5,8.3 23.86,8.3 C15.1 26.58,8.32 29.1,5.8 LED5.ANODE | U1.44 26.45,37.75 | 26.45,37.75 25.7,38.5 25.7,42.6 16.45,51.85 | 26.45,37.75 24.65,37.75 v24,37.1 | 23.8,31.76 C12.1 | C4.1 25.59,26.11 25.45,26.25 25.1,26.6 24.3,26.6 24,26.9 v24,27.2 | 23.8,31.74 C12.1 | C7.1 41.22,11.2 42.4,11.2 42.5,11.1 | 42.5,11.1 42.5,9.6 43.5,8.6 45.1,8.6 46.8,10.3 46.8,12.3 47.74,13.24 LED4.ANODE 48.96,12.54 49.6,11.6 51.1,11.6 53.6,14.4 53.6,21.7 56.3,24.4 59.8,24.4 61.4,26 61.4,31.2 60.4,32.2 58,32.2 LED3.ANODE 57.9,38.9 51.6,45.2 51.6,49.9 51.3,50.2 50.52,50.2 LED2.ANODE 50.4,50.32 50.4,51.3 49.1,52.6 47.1,52.6 47.06,52.64 | 43.3,11.2 42.6,11.2 42.5,11.1 | C12.1 23.81,30.79 v24,30.6 | 24.1,58.7 24.1,61.23 J3.VCC | 7.1,34.6 10.7,34.6 AVRISP.2
  Bottom 0.61: v24,37.1 v24,30.6 v24,27.2
VIN  (via drill 0.36)
  Top 0.254: U1.7 30.55,30.95 v30.7,31 | v14.7,54.45 15.01,54.83 U3.8 | 12.24,54 12.3,54.06 v12.3,55.2 | 10,53.9 12.19,53.9 R4.2 | U3.5 13.82,58.58 13.8,58.6
  Top 0.61: SW1.3 7.87,53.07 8.8,53.9 10,53.9 10,57.2 11.4,58.6 13.8,58.6 | 12.24,54 R4.2
  Bottom 0.254: v30.7,31 30.7,35.1 28.7,37.1 28.7,53.7 27.95,54.45 v14.7,54.45 12.98,54.45 v12.3,55.2
VUSB  (via drill 0.36)
  Top 0.254: 53.8,50 53.82,49.98 U4.4 53.8,49.7 53,49.7 52.5,49.2 52.5,46 52.9,45.6 55.6,45.6 56.42,46.42 U4.1 | J1.P1 5.24,19.21 5.97,19.94
  Top 0.61: v9.9,47.9 7.87,45.87 SW1.2 7.79,45.8 5.8,45.8 1.5,41.5 1.5,26.8 4.4,23.9 4.42,23.9 5.97,22.35 5.97,19.94 | v20.4,51.9 21.1,52.6 23.6,52.6 | 23.6,52.6 30.5,52.6 31.7,53.8 35.7,53.8 v37.6,55.7 | 53.8,50 53.8,52.3 50.4,55.7 47.81,55.7 | v44.1,55.7 47.81,55.7 | 47.81,55.7 D1.C | C11.1 23.6,51.25 23.6,52.6
  Bottom 0.61: v9.9,47.9 10,48 13.1,51.4 19.8,51.4 v20.4,51.9 | v37.6,55.7 v44.1,55.7
(copper drawn outside any net)
  shapes: Bottom area x1, Top area x1

### Text on the board
bPlace: ON | BATTERY | OFF
bNames: +